# Altium schematic sheet ldo-1.SchDoc
size A2; Organization: Protel International P/L; Address1: L3, 12a Rodborough Rd; Address2: Frenchs Forest; Address3: NSW; Address4: Australia 2086
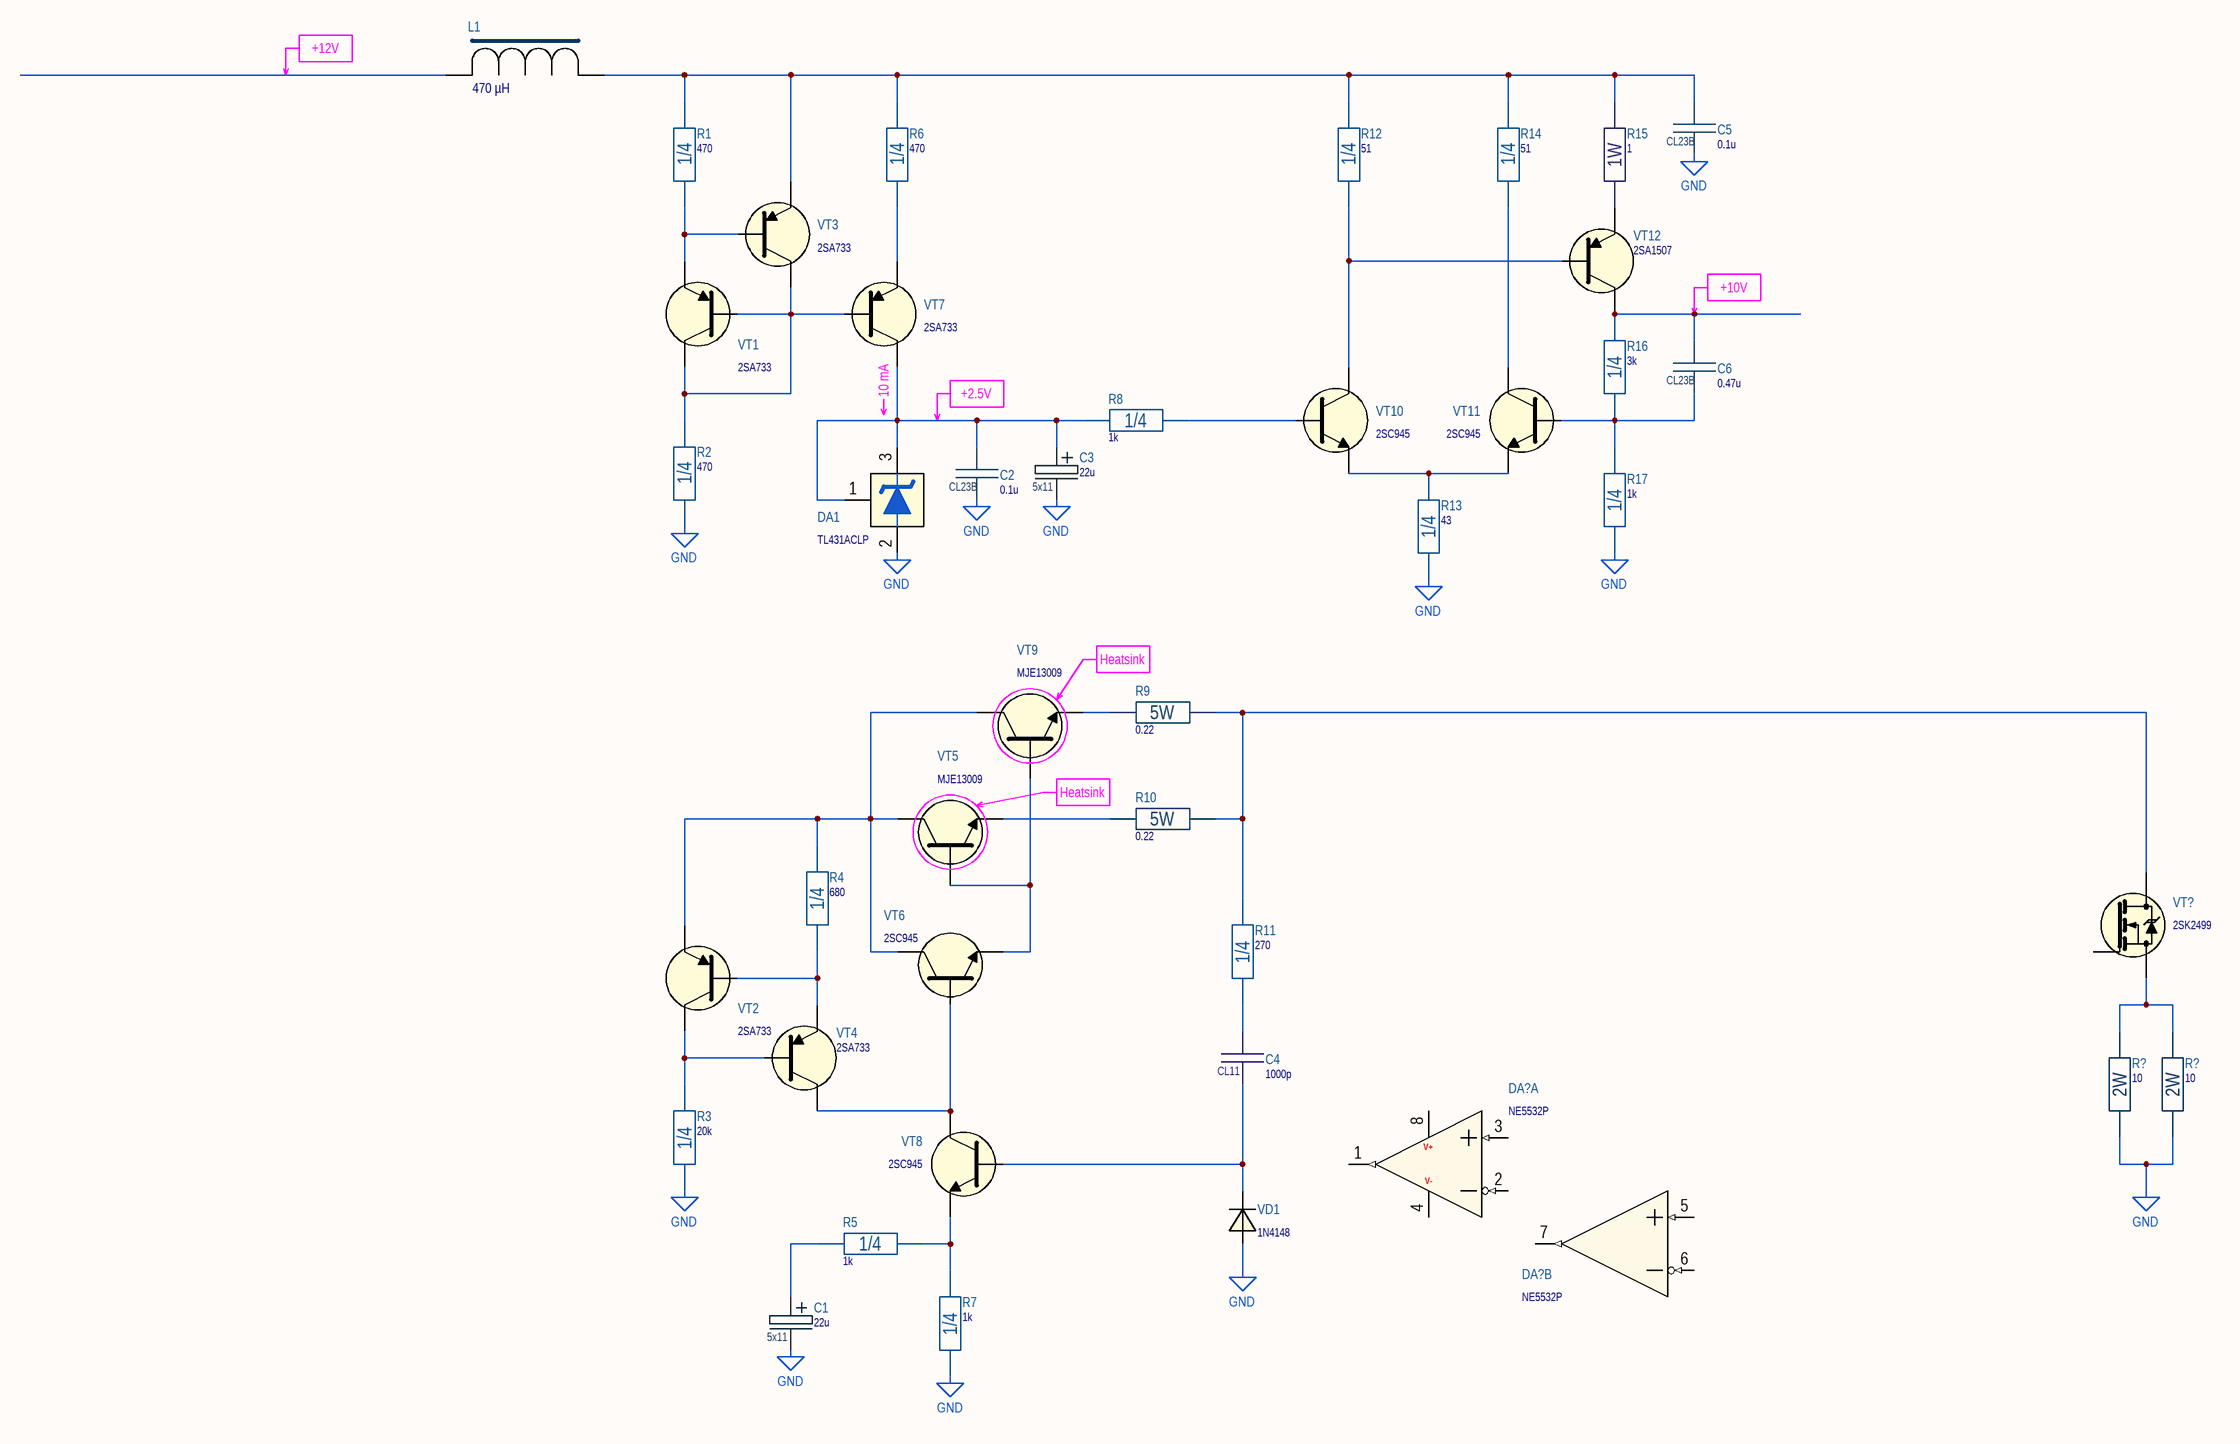
[diagram p0: ldo-1.SchDoc]

## Parts
(Parts that share a designator on the sheet are numbered #1, #2 ... from top to bottom, then left to right.)
C1  22u  Package: 5x11  [ECAP5X11X2.0_BRW]
C2  0.1u  [CL23B_7.2x2.5]
C3  22u  Package: 5x11  [ECAP5X11X2.0_BRW]
C4  1000p  [CL11_6x3.5_P3.5]
C5  0.1u  [CL23B_7.2x2.5]
C6  0.47u  [CL23B_7.2x3.5]
DA1  TL431ACLP  [TO-92 (VERTICAL,LINE)]
DA?#1  NE5532P  [DIP-8P-M01_with_SO8]  (part A of 2)
DA?#2  NE5532P  [DIP-8P-M01_with_SO8]  (part B of 2)
L1  Inductance @ 100 kHz: 470 µH  [RLB0914]  (hidden comment: RLB0914-471KL)
R1  470  Package: 1/4  [CFR-25]
R2  470  Package: 1/4  [CFR-25]
R3  20k  Package: 1/4  [CFR-25]
R4  680  Package: 1/4  [CFR-25]
R5  1k  Package: 1/4  [CFR-25]
R6  470  Package: 1/4  [CFR-25]
R7  1k  Package: 1/4  [CFR-25]
R8  1k  Package: 1/4  [CFR-25]
R9  0.22  Package: 5W  [BPR58]
R10  0.22  Package: 5W  [BPR58]
R11  270  Package: 1/4  [CFR-25]
R12  51  Package: 1/4  [CFR-25]
R13  43  Package: 1/4  [CFR-25]
R14  51  Package: 1/4  [CFR-25]
R15  1  Package: 1W  [CFR-100]
R16  3k  Package: 1/4  [CFR-25]
R17  1k  Package: 1/4  [CFR-25]
R?#1  10  Package: 2W  [CFR-200]
R?#2  10  Package: 2W  [CFR-200]
VD1  1N4148  [DO-35 GLASS LIGHT RED]
VT1  2SA733  [TO-92 (VERTICAL,LINE)]
VT2  2SA733  [TO-92 (VERTICAL,LINE)]
VT3  2SA733  [TO-92 (VERTICAL,LINE)]
VT4  2SA733  [TO-92 (VERTICAL,LINE)]
VT5  MJE13009  [TO-220A-3]
VT6  2SC945  [TO-92 (VERTICAL,LINE)]
VT7  2SA733  [TO-92 (VERTICAL,LINE)]
VT8  2SC945  [TO-92 (VERTICAL,LINE)]
VT9  MJE13009  [TO-220A-3]
VT10  2SC945  [TO-92 (VERTICAL,LINE)]
VT11  2SC945  [TO-92 (VERTICAL,LINE)]
VT12  2SA1507  [TO-126 (VERTICAL)]
VT?  2SK2499  [TO-220AB-3]

## Nets
GND: C1.2 C2.2 C3.2 C5.2 DA1.2(ANODE) R2.1 R3.2 R7.2 R13.2 R17.2 R?#1.1 R?#2.1 VD1.2
NetC1_1: C1.1 R5.2
NetC2_1: C2.1 C3.1 DA1.1(REF) DA1.3(CATHODE) R8.2 VT7.2(C)
NetC4_1: C4.1 VD1.1 VT8.1(B)
NetC4_2: C4.2 R11.2
NetC5_1: C5.1 L1.2 R1.2 R6.2 R12.2 R14.2 R15.2 VT3.3(E)
NetC6_1: C6.1 R16.1 VT12.2(C)
NetC6_2: C6.2 R16.2 R17.1 VT11.1(B)
NetR1_1: R1.1 VT1.3(E) VT3.1(B)
NetR2_2: R2.2 VT1.1(B) VT1.2(C) VT3.2(C) VT7.1(B)
NetR3_1: R3.1 VT2.2(C) VT4.1(B)
NetR4_1: R4.1 VT2.3(E) VT5.2(C) VT6.2(C) VT9.2(C)
NetR4_2: R4.2 VT2.1(B) VT4.3(E)
NetR5_1: R5.1 R7.1 VT8.3(E)
NetR6_1: R6.1 VT7.3(E)
NetR8_1: R8.1 VT10.1(B)
NetR9_1: R9.1 VT9.3(E)
NetR9_2: R9.2 R10.2 R11.1 VT?.2(D)
NetR10_1: R10.1 VT5.3(E)
NetR12_1: R12.1 VT10.2(C) VT12.1(B)
NetR13_1: R13.1 VT10.3(E) VT11.3(E)
NetR14_1: R14.1 VT11.2(C)
NetR15_1: R15.1 VT12.3(E)
NetR?#1_2: R?#1.2 R?#2.2 VT?.3(S)
NetVT4_2: VT4.2(C) VT6.1(B) VT8.2(C)
NetVT5_1: VT5.1(B) VT6.3(E) VT9.1(B)

Not connected (* = marked no-connect by the designer): DA?#1 1(1OUT) 2(1IN-) 3(1IN+) 4(GND) 8(VCC); DA?#2 5(2IN+) 6(2IN-) 7(2OUT); L1 1; VT? 1(G)

## Notes on the sheet
- +12V
- +10V
- (near VT7) 10 mA
- +2.5V
- Heatsink
- Title
- Size:
- Date:
- File:
- A2
- Number:
- Time:
- Revision:
- Sheet
- of
- (in symbol NE5532P, part A) V+; V-

## Library data of the parts
C1 C3 = C_ECAP: Aluminium capacitor; Part Number: UVR1J220MDD; Manufacturer: Nichicon; Tolerance: ± 20 %; Voltage: 63V; Value: 22u; Value on schem: 22u
C2 C5 C6 = CL23B: Box-type metallized polyester film capacitor; Tolerance: ± * %; Voltage: 63V; Dielectric: Polyester; Part Number: *; Manufacturer: *; Package: CL23B
  C2 C5: Value: 0.1u; Value on schem: 0.1u
  C6: Value: 0.47u; Value on schem: 0.47u
C4 = CL11: CL11 Type Polyester Film Metal Foil Capacitor-inductive; Tolerance: ± 5 %; Voltage: 100V; Value: 1000p; Dielectric: Polyester; Value on schem: 1000p; Part Number: *; Manufacturer: *; Package: CL11
DA1 = TL431ACLP: Precision Programmable Reference; Manufacturer: Texas Instruments; Part Number: TL431ACLP; Package: TO-92
DA?#1 DA?#2 = NE5532P: DUAL LOW-NOISE OPERATIONAL AMPLIFIERS; Manufacturer: Texas Instruments; Part Number: NE5532P; Package: DIP-8
L1 = RLB0914: Radial Inductors; Manufacturer: Bourns Inc.; RDC: 1.3 Ohm; SRF Min: 1.8 MHz; Q: 20; Irms  Max: 0.56 A; Isat  Typ: 1 A; Part Number: RLB0914-471KL; Package: 8.7x12mm
R1 R2 R6 = CF25: Resistor 1/4W; Part Number: MFP-25BRD52-470R; Manufacturer: Yageo; Tolerance: ± 0.1 %; Voltage: 250V; Temperature Coefficient: ±20 ppm/°C; Value: 470; Value on schem: 470
R3 = CF25: Resistor 1/4W; Part Number: MFR-25FTF52-20K; Manufacturer: Yageo; Tolerance: ± 1 %; Voltage: 250V; Temperature Coefficient: ±100 ppm/°C; Value: 20k; Value on schem: 20k
R4 = CF25: Resistor 1/4W; Part Number: MFR-25FTF52-680R; Manufacturer: Yageo; Tolerance: ± 1 %; Voltage: 250V; Temperature Coefficient: ±100 ppm/°C; Value: 680; Value on schem: 680
R5 R7 R8 R17 = CF25: Resistor 1/4W; Part Number: MFR-25FTF52-10K; Manufacturer: Yageo; Tolerance: ± 1 %; Voltage: 250V; Temperature Coefficient: ±100 ppm/°C; Value: 1k; Value on schem: 1k
R9 R10 = BPR58: Rectangular type metal plate resistors; Part Number: BPR58CR22J; Manufacturer: KOA Speer; Tolerance: ± 5 %; Temperature Coefficient: ±350 /°C; Value: 0.22; Value on schem: 0.22
R11 = CF25: Resistor 1/4W; Part Number: MFR-25FTF52-270R; Manufacturer: Yageo; Tolerance: ± 1 %; Voltage: 250V; Temperature Coefficient: ±100 ppm/°C; Value: 270; Value on schem: 270
R12 R14 = CF25: Resistor 1/4W; Part Number: MFP-25BRD52-51R; Manufacturer: Yageo; Tolerance: ± 0.1 %; Voltage: 250V; Temperature Coefficient: ±20 ppm/°C; Value: 51; Value on schem: 51
R13 = CF25: Resistor 1/4W; Part Number: MFR-25FTF52-43R; Manufacturer: Yageo; Tolerance: ± 1 %; Voltage: 250V; Temperature Coefficient: ±100 ppm/°C; Value: 43; Value on schem: 43
R15 = CF100: Resistor 1W; Part Number: KNP100FB-73-1R; Manufacturer: Yageo; Tolerance: ± 1 %; Voltage: 250V; Temperature Coefficient: ±200 ppm/°C; Value: 1; Value on schem: 1
R16 = CF25: Resistor 1/4W; Part Number: MFR-25FTF52-3K; Manufacturer: Yageo; Tolerance: ± 1 %; Voltage: 250V; Temperature Coefficient: ±100 ppm/°C; Value: 3k; Value on schem: 3k
R?#1 R?#2 = CF200: Resistor 2W; Part Number: KNP200JB-73-10R; Manufacturer: Yageo; Tolerance: ± 5 %; Voltage: 250V; Temperature Coefficient: ±300 ppm/°C; Value: 10; Value on schem: 10
VD1 = 1N4148: High-speed diode; Package: DO-35; Part Number: 1N4148
VT1-VT4 VT7 = 2SA733: General Purpose p-n-p Transistors; Manufacturer: NEC; Package: TO-92; Part Number: 2SA733
VT5 VT9 = MJE13009: General Purpose n-p-n Transistors 400V, 12A, 100W; Manufacturer: Inchange Semiconductor; Package: TO-220A; Part Number: MJE13009
VT6 VT8 VT10 VT11 = 2SC945: General Purpose n-p-n Transistors; Manufacturer: NEC; Package: TO-92; Part Number: 2SC945
VT12 = 2SA1507: General Purpose p-n-p Transistors -160V, -1.5A; Manufacturer: Inchange Semiconductor; Package: TO-126; Part Number: 2SA1507
VT? = 2SK2499: N-Channel MOSFET, 60V, 50A; Manufacturer: NEC; Part Number: 2SK2499; Package: TO220-3